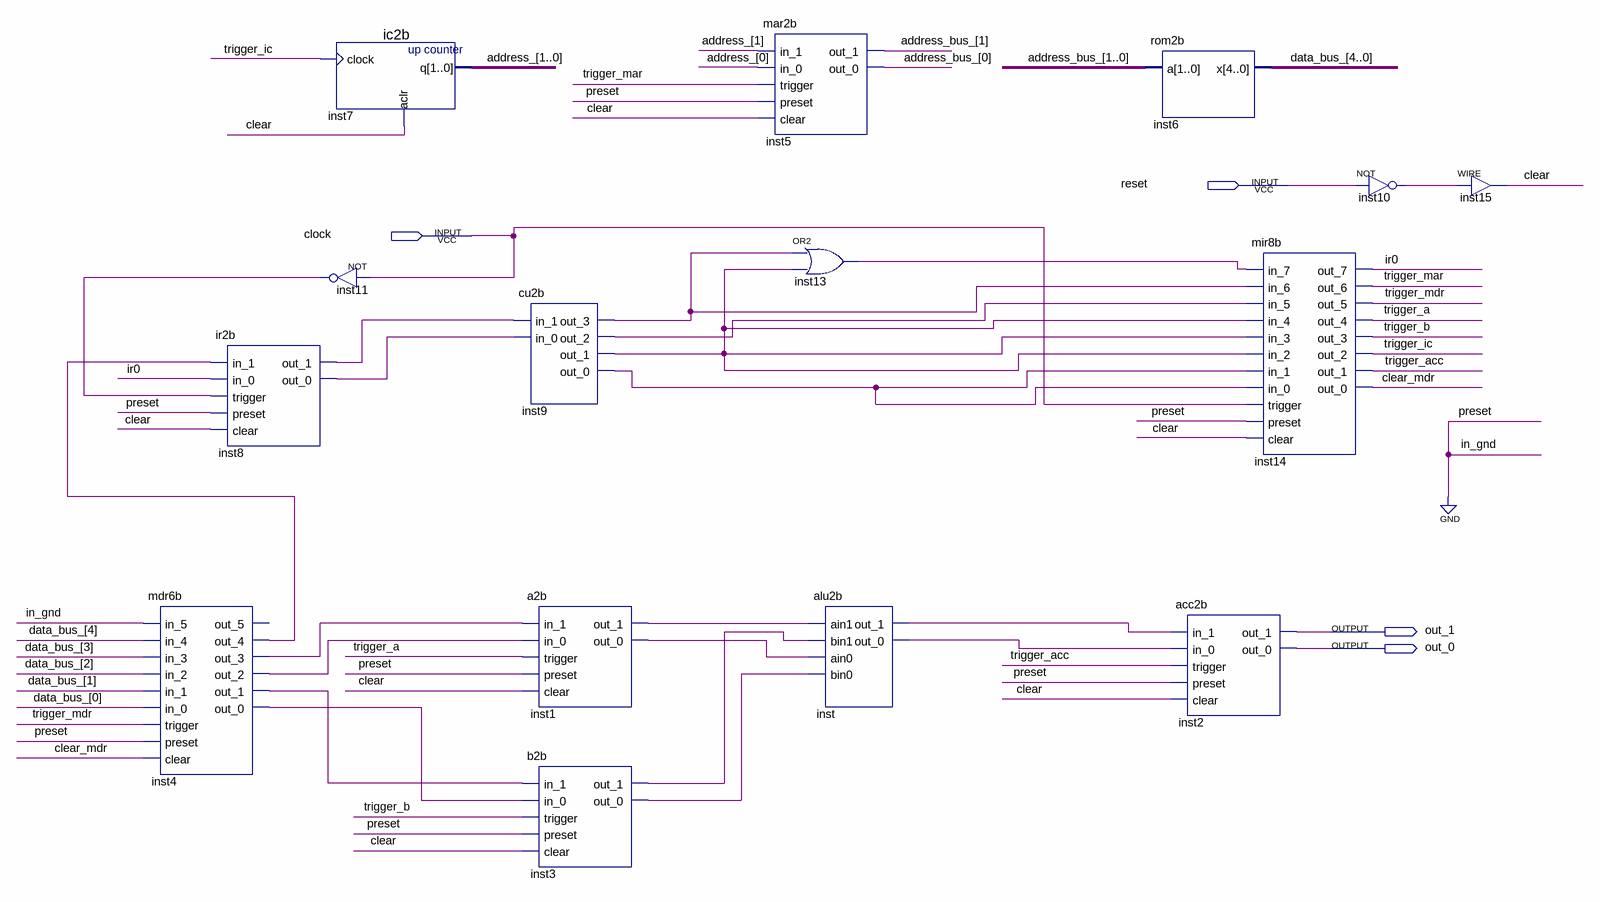
[diagram p0: schematic sheet]
// Quartus schematic FCTArc1.bdf as structural Verilog: 15 symbols, 4 pins
module FCTArc1 (
  input  reset,
  input  clock,
  output out_1,
  output out_0
);

  wire clear, clear_mdr, inst1_out_0, inst1_out_1, inst3_out_0, inst3_out_1, inst4_out_0, inst4_out_1,
       inst4_out_2, inst4_out_3, inst4_out_4, inst8_out_0, inst8_out_1, inst9_out_0, inst9_out_1,
       inst9_out_2, inst9_out_3, inst10_out, inst11_out, inst13_out, inst_out_0, inst_out_1, ir0, trigger_a,
       trigger_acc, trigger_b, trigger_ic, trigger_mar, trigger_mdr;
  wire [1:0] address_, address_bus_;
  wire [4:0] data_bus_;

  mdr6b inst4 (
    .in_5(1'b0), .in_4(data_bus_[4]), .in_3(data_bus_[3]), .in_2(data_bus_[2]), .in_1(data_bus_[1]),
    .in_0(data_bus_[0]), .trigger(trigger_mdr), .preset(1'b0), .clear(clear_mdr), .out_4(inst4_out_4),
    .out_3(inst4_out_3), .out_2(inst4_out_2), .out_1(inst4_out_1), .out_0(inst4_out_0));  // open: out_5
  ir2b inst8 (
    .in_1(inst4_out_4), .in_0(ir0), .trigger(inst11_out), .preset(1'b0), .clear(clear), .out_1(inst8_out_1),
    .out_0(inst8_out_0));
  ic2b inst7 (.clock(trigger_ic), .aclr(clear), .q(address_));
  not inst11 (inst11_out, clock);
  cu2b inst9 (
    .in_1(inst8_out_1), .in_0(inst8_out_0), .out_3(inst9_out_3), .out_2(inst9_out_2), .out_1(inst9_out_1),
    .out_0(inst9_out_0));
  a2b inst1 (
    .in_1(inst4_out_3), .in_0(inst4_out_2), .trigger(trigger_a), .preset(1'b0), .clear(clear),
    .out_1(inst1_out_1), .out_0(inst1_out_0));
  b2b inst3 (
    .in_1(inst4_out_1), .in_0(inst4_out_0), .trigger(trigger_b), .preset(1'b0), .clear(clear),
    .out_1(inst3_out_1), .out_0(inst3_out_0));
  mar2b inst5 (
    .in_1(address_[1]), .in_0(address_[0]), .trigger(trigger_mar), .preset(1'b0), .clear(clear),
    .out_1(address_bus_[1]), .out_0(address_bus_[0]));
  or inst13 (inst13_out, inst9_out_3, inst9_out_1);
  alu2b inst (
    .ain1(inst1_out_1), .bin1(inst3_out_1), .ain0(inst1_out_0), .bin0(inst3_out_0), .out_1(inst_out_1),
    .out_0(inst_out_0));
  rom2b inst6 (.a(address_bus_), .x(data_bus_));
  acc2b inst2 (
    .in_1(inst_out_1), .in_0(inst_out_0), .trigger(trigger_acc), .preset(1'b0), .clear(clear), .out_1(out_1),
    .out_0(out_0));
  mir8b inst14 (
    .in_7(inst13_out), .in_6(inst9_out_3), .in_5(inst9_out_2), .in_4(inst9_out_1), .in_3(inst9_out_1),
    .in_2(inst9_out_1), .in_1(inst9_out_0), .in_0(inst9_out_0), .trigger(clock), .preset(1'b0),
    .clear(clear), .out_7(ir0), .out_6(trigger_mar), .out_5(trigger_mdr), .out_4(trigger_a),
    .out_3(trigger_b), .out_2(trigger_ic), .out_1(trigger_acc), .out_0(clear_mdr));
  not inst10 (inst10_out, reset);
  assign clear = inst10_out;  // WIRE inst15
endmodule
